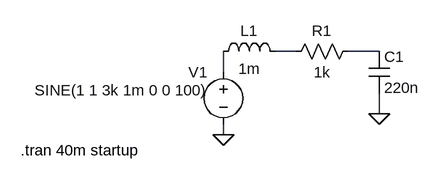
[diagram p0: schematic damping-sin3k.asc]
damping-sin3k.asc, the LTspice schematic file:
Version 4
SHEET 1 880 680
WIRE 160 144 128 144
WIRE 288 144 240 144
WIRE 48 176 48 144
WIRE 288 240 288 208
WIRE 48 272 48 256
FLAG 288 240 0
FLAG 48 272 0
SYMBOL res 256 128 R90
WINDOW 0 0 56 VBottom 2
WINDOW 3 32 56 VTop 2
SYMATTR InstName R1
SYMATTR Value 1k
SYMBOL cap 272 144 R0
SYMATTR InstName C1
SYMATTR Value 220n
SYMBOL ind 32 160 R270
WINDOW 0 32 56 VTop 2
WINDOW 3 5 56 VBottom 2
SYMATTR InstName L1
SYMATTR Value 1m
SYMBOL voltage 48 160 M0
WINDOW 123 24 124 Left 2
WINDOW 39 0 0 Left 0
WINDOW 3 24 44 Left 2
SYMATTR InstName V1
SYMATTR Value SINE(1 1 3k 1m 0 0 100)
TEXT -264 296 Left 2 !.tran 40m startup

The netlist it stands for:
* damping-sin3k.asc
R1 N002 N001 1k
C1 N002 0 220n
L1 N003 N001 1m
V1 N003 0 SINE(1 1 3k 1m 0 0 100)
.tran 40m startup
.backanno
.end